# Altium schematic sheet MT6305B_TestCircuit.SchDoc
size A4
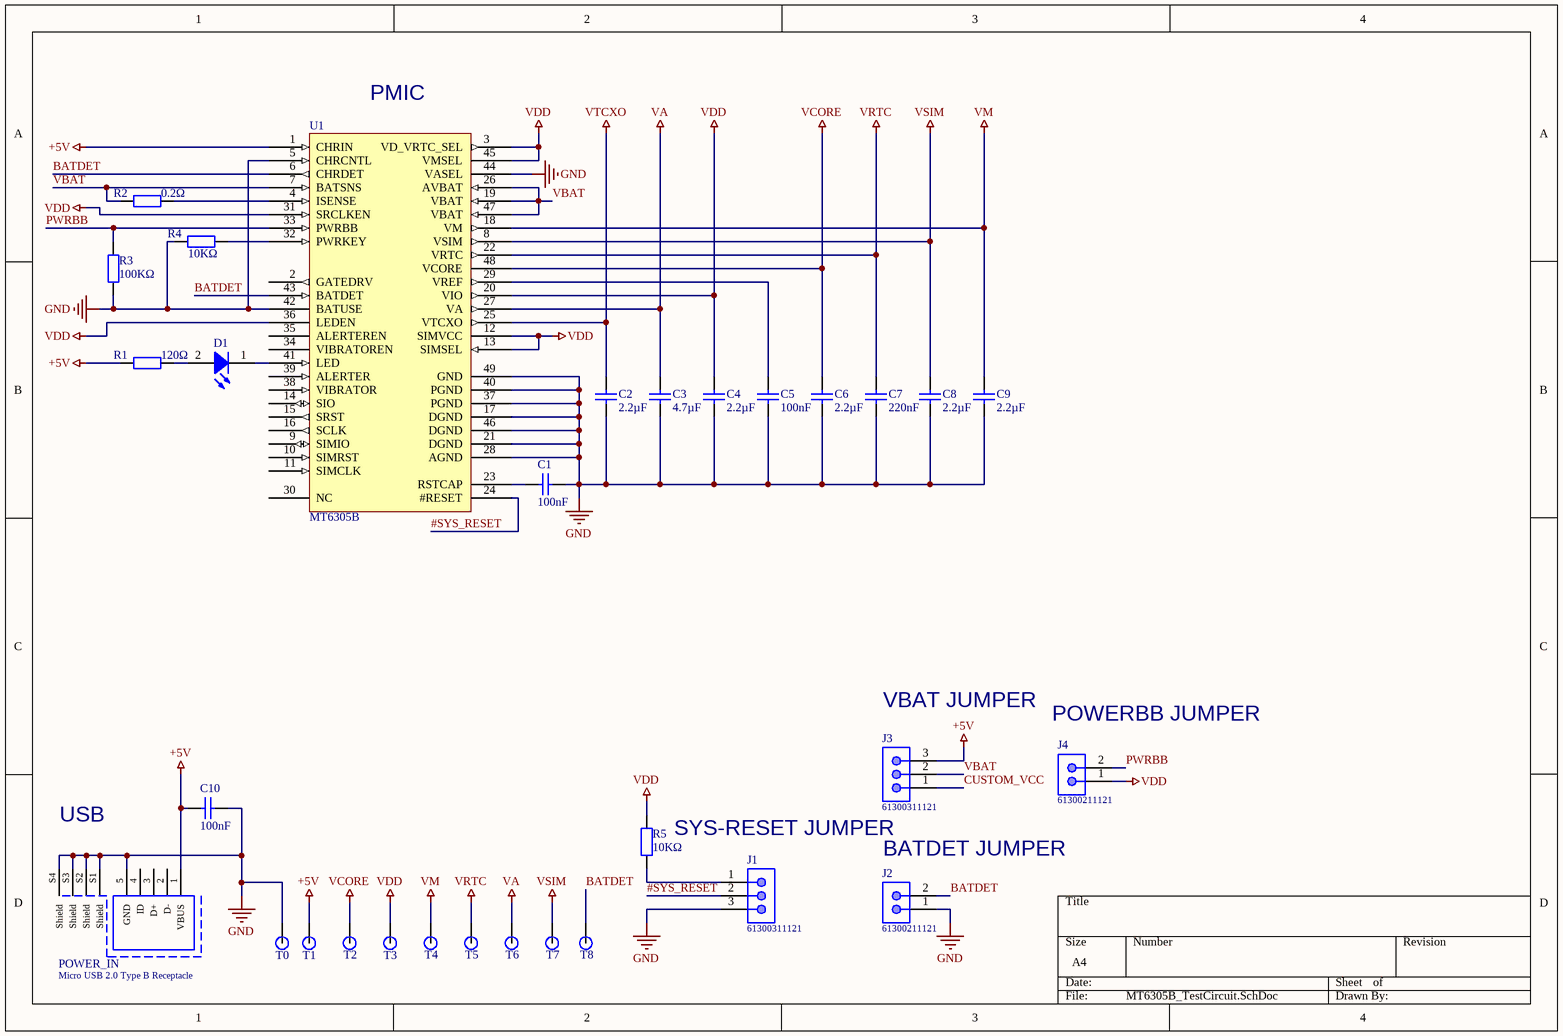
[diagram p0: MT6305B_TestCircuit.SchDoc]

## Parts
C1  100nF  [WCAP-CSGP_0805_H=0.8mm_Reflow]
C2  2.2µF  [WCAP-CSGP_0805_H=0.8mm_Reflow]
C3  4.7µF  [WCAP-CSGP_0805_H=0.8mm_Reflow]
C4  2.2µF  [WCAP-CSGP_0805_H=0.8mm_Reflow]
C5  100nF  [WCAP-CSGP_0805_H=0.8mm_Reflow]
C6  2.2µF  [WCAP-CSGP_0805_H=0.8mm_Reflow]
C7  220nF  [WCAP-CSGP_0805_H=0.8mm_Reflow]
C8  2.2µF  [WCAP-CSGP_0805_H=0.8mm_Reflow]
C9  2.2µF  [WCAP-CSGP_0805_H=0.8mm_Reflow]
C10  100nF  [WCAP-CSGP_0805_H=0.8mm_Reflow]
D1  (no value)  [WL-SMCW_0805]
J1  61300311121  [61300311121]
J2  61300211121  [61300211121]
J3  61300311121  [61300311121]
J4  61300211121  [61300211121]
POWER_IN  Micro USB 2.0 Type B Receptacle  [629105136821]
R1  120Ω  [WRIS-PSMB_0805_H=0.22mm]
R2  0.2Ω  [WRIS-PSMB_0805_H=0.22mm]
R3  100KΩ  [WRIS-PSMB_0805_H=0.22mm]
R4  10KΩ  [WRIS-PSMB_0805_H=0.22mm]
R5  10KΩ  [WRIS-PSMB_0805_H=0.22mm]
T0  (no value)  [Testpoint]
T1  (no value)  [Testpoint]
T2  (no value)  [Testpoint]
T3  (no value)  [Testpoint]
T4  (no value)  [Testpoint]
T5  (no value)  [Testpoint]
T6  (no value)  [Testpoint]
T7  (no value)  [Testpoint]
T8  (no value)  [Testpoint]
U1  MT6305B  [MT6305]

## Nets
+5V: C10.1 J3.3 POWER_IN.1(VBUS) R1.1 T1.1 U1.1(CHRIN)
GND: C1.2 C2.2 C3.2 C4.2 C5.2 C6.2 C7.2 C8.2 C9.2 C10.2 J1.3 J2.1 POWER_IN.5(GND) POWER_IN.S1(Shield) POWER_IN.S2(Shield) POWER_IN.S3(Shield) POWER_IN.S4(Shield) R3.1 R4.2 T0.1 U1.5(CHRCNTL) U1.17(DGND) U1.21(DGND) U1.28(AGND) U1.37(PGND) U1.40(PGND) U1.42(BATUSE) U1.44(VASEL) U1.46(DGND) U1.49(GND)
VA: C3.1 T6.1 U1.27(VA)
VCORE: C6.1 T2.1 U1.48(VCORE)
VDD: C4.1 J4.1 R5.1 T3.1 U1.3(VD_VRTC_SEL) U1.12(SIMVCC) U1.13(SIMSEL) U1.20(VIO) U1.31(SRCLKEN) U1.36(LEDEN) U1.45(VMSEL)
VM: C9.1 T4.1 U1.18(VM)
VRTC: C7.1 T5.1 U1.22(VRTC)
VSIM: C8.1 T7.1 U1.8(VSIM)
VTCXO: C2.1 U1.25(VTCXO)
#SYS_RESET: J1.2 U1.24(#RESET)
BATDET: J2.2 T8.1 U1.6(CHRDET) U1.43(BATDET)
CUSTOM_VCC: J3.1
PWRBB: J4.2 R3.2 U1.33(PWRBB)
VBAT: J3.2 R2.1 U1.7(BATSNS) U1.19(VBAT) U1.26(AVBAT) U1.47(VBAT)
NetC1_1: C1.1 U1.23(RSTCAP)
NetC5_1: C5.1 U1.29(VREF)
NetD1_1: D1.1(K) U1.41(LED)
NetD1_2: D1.2(A) R1.2
NetJ1_1: J1.1 R5.2
NetR2_2: R2.2 U1.4(ISENSE)
NetR4_1: R4.1 U1.32(PWRKEY)

Not connected (* = marked no-connect by the designer): POWER_IN 2(D-) 3(D+) 4(ID); U1 2(GATEDRV) 9(SIMIO) 10(SIMRST) 11(SIMCLK) 14(SIO) 15(SRST) 16(SCLK) 30(NC) 34(VIBRATOREN) 35(ALERTEREN) 38(VIBRATOR) 39(ALERTER)

## Notes on the sheet
- (near U1) PMIC
- (near J3) VBAT JUMPER
- (near J4) POWERBB JUMPER
- USB
- SYS-RESET JUMPER
- BATDET JUMPER

## Library data of the parts
C1-C10 = Cap: Capacitor; Published: 8-Jun-2000; LatestRevisionDate: 17-Jul-2002; LatestRevisionNote: Re-released for DXP Platform.; PackageReference: RAD-0.3; Publisher: Altium Limited; PackageDescription: Radial Cap, Thru-Hole; 2 Leads; 0.3 in Pin Spacing
D1 = 150080BS75000: SMT Mono-color Chip LED Waterclear WL-SMCW, size 0805, Blue, 3.2 V, 140 deg, 145 mcd; Forward Voltage: 3.2 V; Viewing Angle: 140 deg; Peak Wavelength: 465 nm; Dominant Wavelength: 470 nm; Luminous Intensity: 145 mcd; Chip Technology: InGaN; ComponentLink1Description: Manufacturer; ComponentLink1URL: http://www.we-online.de; ComponentLink2Description: Datasheet; ComponentLink2URL: https://katalog.we-online.de/led/datasheet/150080BS75000.pdf; Part Number: 150080BS75000; Published Date: November 2018; Publisher: Wurth Elektronik; Size: 0805; Operating Temperature: -40 to 85 degC; Emitting Color: Blue; Mounting Technology: SMT; Packaging: Tape and Reel
J1 J3 = 61300311121: WR-PHD Pin Header, THT, pitch 2.54mm, Single Row, Vertical, 3pin; Pin Number: 3; Gender: Male; Rated Current: 3A; Working Voltage: 250VAC; Withstanding Voltage: 500VAC; Contact Resistance: 20mOhm; ComponentLink1Description: Manufacturer; ComponentLink1URL: http://www.we-online.de; ComponentLink2Description: Datasheet; ComponentLink2URL: https://katalog.we-online.de/em/datasheet/6130xx11121.pdf; Part Number: 61300311121; Published Date: June 2019; Publisher: Wurth Elektronik; Pitch: 2.54mm; Operating Temperature: -40 to +105degC; Mounting Technology: THT; Packaging: Bag; Row Number: Single; Orientation: Vertical
J2 J4 = 61300211121: WR-PHD Pin Header, THT, pitch 2.54mm, Single Row, Vertical, 2pin; Pin Number: 2; Gender: Male; Rated Current: 3A; Working Voltage: 250VAC; Withstanding Voltage: 500VAC; Contact Resistance: 20mOhm; ComponentLink1Description: Manufacturer; ComponentLink1URL: http://www.we-online.de; ComponentLink2Description: Datasheet; ComponentLink2URL: https://katalog.we-online.de/em/datasheet/6130xx11121.pdf; Part Number: 61300211121; Published Date: June 2019; Publisher: Wurth Elektronik; Pitch: 2.54mm; Operating Temperature: -40 to +105degC; Mounting Technology: THT; Packaging: Bag; Row Number: Single; Orientation: Vertical
POWER_IN = 629105136821: Micro USB 2.0 Type B, Receptacle, Horizontal, SMT; Rated Current: 1A; Pin Number: 5; Interface Type: Type B; Working Voltage: 30VAC; ComponentLink1Description: Manufacturer; ComponentLink1URL: http://www.we-online.de; ComponentLink2Description: Datasheet; ComponentLink2URL: https://katalog.we-online.com/em/datasheet/629105136821.pdf; Published Date: September 2019; Publisher: Wurth Elektronik; Part Number: 629105136821; Gender: Receptacle; Type: Horizontal; Packaging: Tape and Reel; Operating Temperature: -40 to +105degC; Mounting Technology: SMT; Application: Micro USB 2.0
R1-R5 = Res2: Resistor; Published: 8-Jun-2000; LatestRevisionDate: 17-Jul-2002; LatestRevisionNote: Re-released for DXP Platform.; PackageReference: AXIAL-0.4; Publisher: Altium Limited; PackageDescription: Axial Device, Thru-Hole; 2 Leads; 0.4 in Pin Spacing
T0-T8 = Testpoint